# Altium schematic sheet ST_LINK_V2.SCHDOC
size A4; DocumentNumber: 2; Revision: D.1(PCB.SCH); SheetNumber: 2; SheetTotal: 6
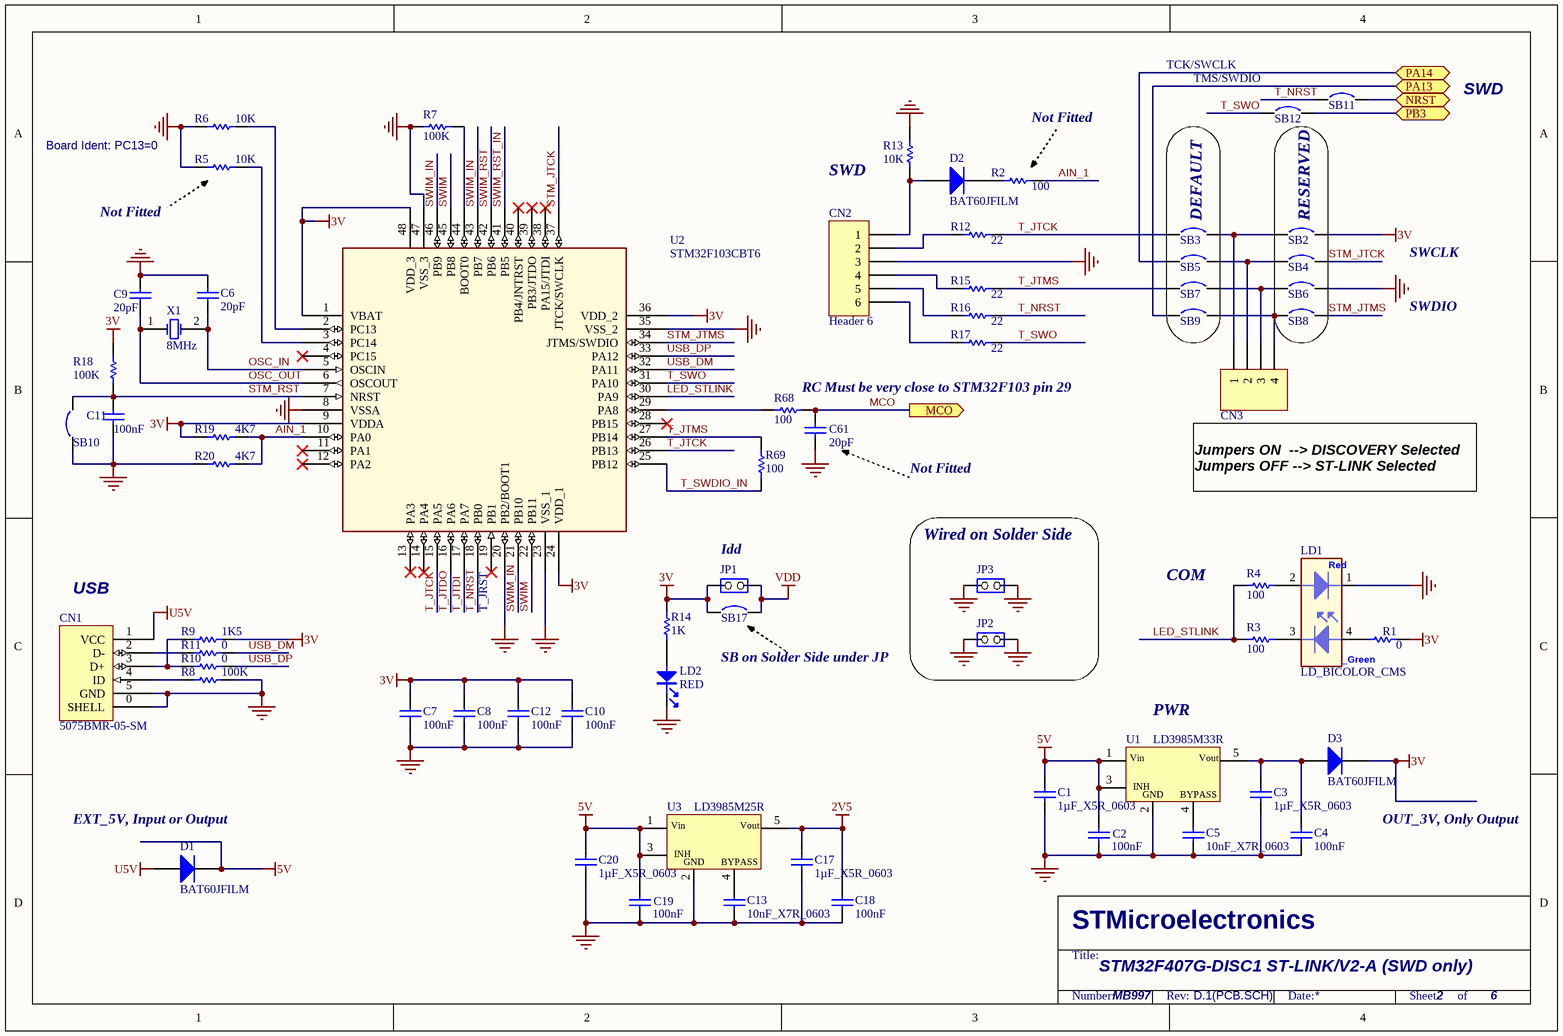
[diagram p0: ST_LINK_V2.SCHDOC]

## Parts
C1  1µF_X5R_0603  [0603C]
C2  100nF  [0603C]
C3  1µF_X5R_0603  [0603C]
C4  100nF  [0603C]
C5  10nF_X7R_0603  [0603C]
C6  20pF  [0402C]
C7  100nF  [0402C]
C8  100nF  [0402C]
C9  20pF  [0402C]
C10  100nF  [0402C]
C11  100nF  [0402C]
C12  100nF  [0402C]
C13  10nF_X7R_0603  [0603C]
C17  1µF_X5R_0603  [0603C]
C18  100nF  [0603C]
C19  100nF  [0603C]
C20  1µF_X5R_0603  [0603C]
C61  20pF  [0402C]
CN1  5075BMR-05-SM  [USB-MINI-B-SMD]
CN2  Header 6  [HDR1X6]
CN3  Header 4  [Header 4]  (value not drawn)
D1  BAT60JFILM  [SOD323/A]
D2  BAT60JFILM  [SOD323/A]
D3  BAT60JFILM  [SOD323/A]
JP1  (no value)  [SIP2/2.54]
JP2  (no value)  [SIP2/2.54]
JP3  (no value)  [SIP2/2.54]
LD1  LD_BICOLOR_CMS  [HSMF-A201]
LD2  RED  [0603D]
R1  0  [0402R]
R2  100  [0402R]
R3  100  [0402R]
R4  100  [0402R]
R5  10K  [0402R]
R6  10K  [0402R]
R7  100K  [0402R]
R8  100K  [0402R]
R9  1K5  [0402R]
R10  0  [0603R]
R11  0  [0603R]
R12  22  [0402R]
R13  10K  [0402R]
R14  1K  [0402R]
R15  22  [0402R]
R16  22  [0402R]
R17  22  [0402R]
R18  100K  [0402R]
R19  4K7  [0402R]
R20  4K7  [0402R]
R68  100  [0402R]
R69  100  [0402R]
SB2  Circuit Breaker  [JP2_SMD]  (value not drawn)
SB3  Circuit Breaker  [JP2_SMD]  (value not drawn)
SB4  Circuit Breaker  [JP2_SMD]  (value not drawn)
SB5  Circuit Breaker  [JP2_SMD]  (value not drawn)
SB6  Circuit Breaker  [JP2_SMD]  (value not drawn)
SB7  Circuit Breaker  [JP2_SMD]  (value not drawn)
SB8  Circuit Breaker  [JP2_SMD]  (value not drawn)
SB9  Circuit Breaker  [JP2_SMD]  (value not drawn)
SB10  Circuit Breaker  [JP2_SMD]  (value not drawn)
SB11  Circuit Breaker  [JP2_SMD]  (value not drawn)
SB12  Circuit Breaker  [JP2_SMD]  (value not drawn)
SB17  Circuit Breaker  [JP2_SMD]  (value not drawn)
U1  LD3985M33R  [SOT-23-5L]
U2  STM32F103CBT6  [QFP48 7x7]
U3  LD3985M25R  [SOT-23-5L]
X1  8MHz  [XTAL1]

## Blocks framed on the sheet
DEFAULT: SB3 SB5 SB7 SB9
RESERVED: SB2 SB4 SB6 SB8
Wired on Solder Side: JP2 JP3

## Ports
MCO (out), NRST, PA13, PA14, PB3

## Nets
2V5: C17.1 C18.2 U3.5(Vout)
3V: C7.2 C8.2 C10.2 C12.1 D3.2(K) JP1.1(COMMON) R1.2 R9.2 R14.2 R18.2 R19.1 SB2.2 SB17.1 U2.1(VBAT) U2.9(VDDA) U2.24(VDD_1) U2.36(VDD_2) U2.48(VDD_3)
5V: C1.2 C2.2 C19.2 C20.2 D1.2(K) U1.1(Vin) U1.3(CE) U3.1(Vin) U3.3(CE)
GND: C1.1 C2.1 C3.2 C4.1 C5.1 C6.1 C7.1 C8.1 C9.1 C10.1 C11.1 C12.2 C13.1 C17.2 C18.1 C19.1 C20.1 C61.2 CN1.0(SHELL) CN1.5(GND) CN2.3 JP2.1(COMMON) JP2.2(NO) JP3.1(COMMON) JP3.2(NO) LD1.1 LD2.2 R5.1 R6.1 R7.1 R8.2 R13.2 R20.1 SB6.2 SB10.1 U1.2(GND) U2.8(VSSA) U2.20(PB2/BOOT1) U2.23(VSS_1) U2.35(VSS_2) U2.47(VSS_3) U3.2(GND)
U5V: CN1.1(VCC) D1.1(A)
VDD: JP1.2(NO) SB17.2
AIN_1: R2.2 R19.2 R20.2 U2.10(PA0)
LED_STLINK: R3.1 R4.1 U2.30(PA9)
MCO: C61.1 R68.2 ; port MCO
NRST: SB11.2 ; port NRST
OSC_IN: C6.2 U2.5(OSCIN) X1.2(OSC2)
OSC_OUT: C9.2 U2.6(OSCOUT) X1.1(OSC1)
PA13: SB9.1 ; port PA13
PA14: SB5.1 ; port PA14
PB3: SB12.2 ; port PB3
STM_JTCK: SB4.2 U2.37(JTCK/SWCLK)
STM_JTMS: SB8.2 U2.34(JTMS/SWDIO)
STM_RST: C11.2 R18.1 SB10.2 U2.7(NRST)
SWIM: U2.22(PB11) U2.45(PB8)
SWIM_IN: U2.21(PB10) U2.43(PB7) U2.46(PB9)
SWIM_RST: U2.42(PB6)
SWIM_RST_IN: U2.41(PB5)
T_JTCK: R12.2 SB3.1 U2.15(PA5) U2.26(PB13)
T_JTDI: U2.17(PA7)
T_JTDO: U2.16(PA6)
T_JTMS: R15.2 R69.2 SB7.1 U2.27(PB14)
T_NRST: R16.2 SB11.1 U2.18(PB0)
T_SWDIO_IN: R69.1 U2.25(PB12)
T_SWO: R17.2 SB12.1 U2.31(PA10)
USB_DM: R11.2 U2.32(PA11)
USB_DP: R10.2 U2.33(PA12)
NetC3_1: C3.1 C4.2 D3.1(A) U1.5(Vout)
NetC5_2: C5.2 U1.4(BYPASS)
NetC13_2: C13.2 U3.4(BYPASS)
NetCN1_2: CN1.2(D-) R11.1
NetCN1_3: CN1.3(D+) R9.1 R10.1
NetCN1_4: CN1.4(ID) R8.1
NetCN2_1: CN2.1 D2.1(A) R13.1
NetCN2_2: CN2.2 R12.1
NetCN2_4: CN2.4 R15.1
NetCN2_5: CN2.5 R16.1
NetCN2_6: CN2.6 R17.1
NetCN3_1: CN3.1 SB2.1 SB3.2
NetCN3_2: CN3.2 SB4.1 SB5.2
NetCN3_3: CN3.3 SB6.1 SB7.2
NetCN3_4: CN3.4 SB8.1 SB9.2
NetD2_2: D2.2(K) R2.1
NetLD1_2: LD1.2 R4.2
NetLD1_3: LD1.3 R3.2
NetLD1_4: LD1.4 R1.1
NetLD2_1: LD2.1 R14.1
NetR5_2: R5.2 U2.3(PC14)
NetR6_2: R6.2 U2.2(PC13)
NetR7_2: R7.2 U2.44(BOOT0)
NetR68_1: R68.1 U2.29(PA8)

Not connected (* = marked no-connect by the designer): U2 4(PC15)* 11(PA1)* 12(PA2)* 13(PA3)* 14(PA4)* 19(PB1)* 28(PB15)* 38(PA15/JTDI)* 39(PB3/JTDO)* 40(PB4/JNTRST)*

## Notes on the sheet
- TCK/SWCLK
- (near SB12) TMS/SWDIO
- SWD
- Board Ident: PC13=0
- Not Fitted
- SWCLK
- SWDIO
- (near R68) RC Must be very close to STM32F103 pin 29
- Jumpers ON  --> DISCOVERY Selected
  Jumpers OFF --> ST-LINK Selected
- (near JP1) Idd
- COM
- (near CN1) USB
- (near U2) T_JRST
- SB on Solder Side under JP
- (near U1) PWR
- (near D1) EXT_5V, Input or Output
- OUT_3V, Only Output
- STM32F407G-DISC1 ST-LINK/V2-A (SWD only)
- MB997
- STMicroelectronics
- Title:
- Number:
- Rev:
- Date:
- Sheet       of
- (in symbol LD3985M25R) INH
- (in symbol LD3985M33R) INH
- (in symbol LD_BICOLOR_CMS) Red; _Green

## Library data of the parts
C1 C3 C17 C20 = CAP SMD 0603  X5R 1µF 25V 10%: 0603  X5R 1µF; Rated voltage: 25V; Tolerance: 10%; Manufacturer: *; Manufacturer P/N: *; Order code Farnell: 1288202RL; Value: 1µF; Power: *; Technology: X5R; Temperature  Factor: *; Temperature Max: +125°C; Temperature Min: -55°C; STS Code: *
C2 C4 C6-C12 C18 C19 = Cap: Capacitor; Published: 8-Jun-2000; Revision: July-2002: Re-released for DXP Platform.; Publisher: Altium Limited
  C2 C4 C7 C8 C10-C12 C18 C19: Value: 100nF
  C6 C9: Value: 20pF
C5 C13 = CAP SMD 0603  X7R 10000PF 50V 10%: 0603  X7R 10NF; Order code RS: 2040779; Rated voltage: 50V; Tolerance: 10%; Order code Farnell: 7569548RL; Value: 10NF; Power: *; Technology: X7R; Temperature Factor: *; Temperature Min: -55°C; Temperature Max: +125°C; STS Code: *
C61 = Cap: Capacitor; Fitted: NO; Published: 8-Jun-2000; Publisher: Altium Limited; Value: 20pF; Revision: July-2002: Re-released for DXP Platform.
CN1 = USB-MINI-typeB connector
CN2 = Header 6: Header, 6-Pin; LatestRevisionDate: 17-Jul-2002; LatestRevisionNote: Re-released for DXP Platform.; Publisher: Altium Limited
CN3 = Header 4: Header, 4-Pin; Revision: 17-Jul-2002: Re-released for DXP Platform.; Publisher: Altium Limited
D1-D3 = BAT60JFILM: Manuf_1: STM; Code - JEDEC: DO-214-AB; Provided: ST; Published: 8-Jun-2000; Revision: July-2002: Re-released for DXP Platform.; Publisher: Altium Limited; Order: BAT60JFILM; Manuf_Part_1: BAT60JFILM
JP1-JP3 = JP2
LD1 = LD_BICOLOR_CMS: Bicolor Led; Manuf_Part_1: HSMF-A201-A00J1; Manuf_1: Avago Technologies; Ref St: xxxxxx; cap_dec: ----; Distrib: RADIOSPARES; support: ----
LD2 = PHOTO
R1 R3 R4 R6-R9 R12-R20 R68 R69 = res1: Resistor; Published: 8-Jun-2000; Revision: July-2002: Re-released for DXP Platform.; Publisher: Altium Limited
  R1: Value: 0
  R3 R4 R68 R69: Value: 100
  R6 R13: Value: 10K
  R7 R8 R18: Value: 100K
  R9: Value: 1K5
  R12 R15-R17: Value: 22
  R14: Value: 1K
  R19 R20: Value: 4K7
R2 R5 = res1: Resistor; Fitted: NO; Published: 8-Jun-2000; Revision: July-2002: Re-released for DXP Platform.; Publisher: Altium Limited
  R2: Value: 100
  R5: Value: 10K
R10 R11 = res1: Resistor; Value: 10; Published: 8-Jun-2000; Revision: July-2002: Re-released for DXP Platform.; Publisher: Altium Limited
SB2 SB4 SB6 SB8 SB11 SB12 SB17 = Circuit Breaker: Solder: YES; Published: 24-Mar-1999; Revision: July-2002: Re-released for DXP Platform.; Publisher: Altium Limited
SB3 SB5 SB7 SB9 SB10 = Circuit Breaker: Solder: NO; Published: 24-Mar-1999; Revision: July-2002: Re-released for DXP Platform.; Publisher: Altium Limited
U1 = LD3985M33R: Ultra low drop-low noise BiCMOS voltage, regulators low ESR capacitors compatible; Manuf_1: STM; Provided: ST; Manuf_Part_1: LD3985M33R
U2 = STM32F103CBT6: Medium-density performance line ARM-based 32-bit MCU with 128KB Flash; Manuf_1: STM; Ref St: xxxxxxxx; Provided: ST; ECCN_US/EU: 3A991A2/NEC; Footprint: QFP48 7X7; Manuf_Part_1: STM32F103CBT6; Order: STM32F103CBT6; Distrib: ST
U3 = LD3985M25R: Ultra low drop-low noise BiCMOS voltage, regulators low ESR capacitors compatible; Manuf_1: STM; Provided: ST; Manuf_Part_1: LD3985M25R
X1 = XTAL: Crystal Oscillator; Published: 8-Jun-2000; LatestRevisionDate: 17-Jul-2002; LatestRevisionNote: Re-released for DXP Platform.; PackageReference: R38; Publisher: Altium Limited